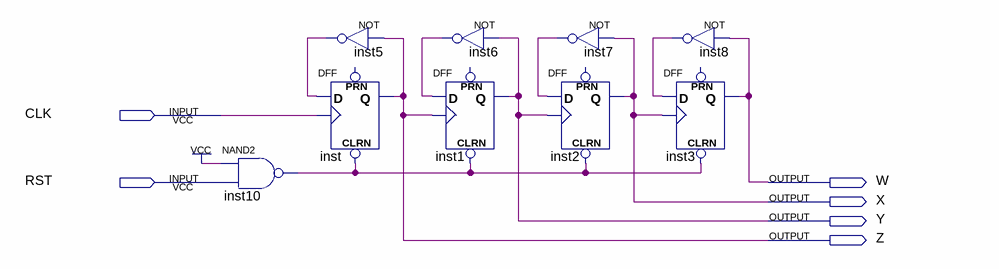
[diagram p0: schematic sheet]
// Quartus schematic 4BIT-DOWNCOUNTER.bdf as structural Verilog: 9 symbols, 6 pins
module \4BIT-DOWNCOUNTER  (
  input  CLK,
  input  RST,
  output W,
  output X,
  output Y,
  output Z
);

  wire inst5_out, inst6_out, inst7_out, inst8_out, inst10_out;

  nand inst10 (inst10_out, 1'b1, RST);
  not inst5 (inst5_out, Z);
  DFF inst (.CLRN(inst10_out), .CLK(CLK), .D(inst5_out), .Q(Z));  // open: PRN
  not inst6 (inst6_out, Y);
  DFF inst1 (.CLRN(inst10_out), .CLK(Z), .D(inst6_out), .Q(Y));  // open: PRN
  not inst7 (inst7_out, X);
  DFF inst2 (.CLRN(inst10_out), .CLK(Y), .D(inst7_out), .Q(X));  // open: PRN
  not inst8 (inst8_out, W);
  DFF inst3 (.CLRN(inst10_out), .CLK(X), .D(inst8_out), .Q(W));  // open: PRN
endmodule
